# Altium schematic sheet SCHEM FINAL.SchDoc
size A
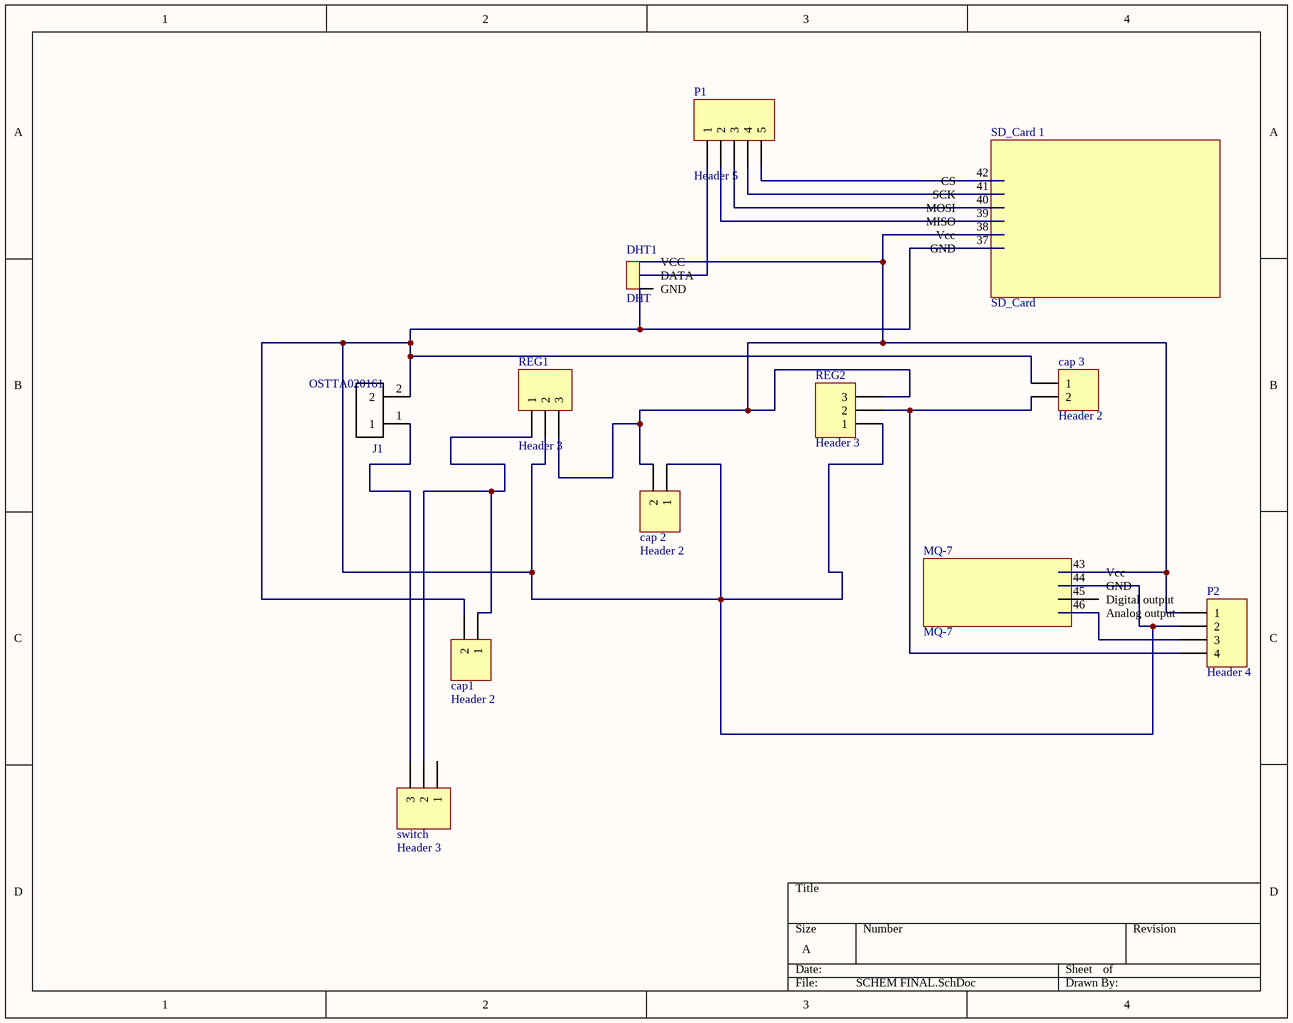
[diagram p0: SCHEM FINAL.SchDoc]

## Parts
cap1  Header 2  [HDR1X2]
cap_2  Header 2  [HDR1X2]
cap_3  Header 2  [HDR1X2]
DHT1  DHT  [PCBComponent_1]
J1  OSTTA020161  [*OST_OSTTA020161]
MQ-7  MQ-7  [MQ-7]
P1  Header 5  [HDR1X5]
P2  Header 4  [HDR1X4]
REG1  Header 3  [HDR1X3]
REG2  Header 3  [HDR1X3]
SD_Card_1  SD_Card  [SD_Card]
switch  Header 3  [HDR1X3]

## Nets
Netcap1_1: cap1.1 REG1.1 switch.2
Netcap1_2: cap1.2 cap_2.1 cap_3.1 DHT1.11(GND) J1.2 MQ-7.44(GND) P2.2 REG1.2 REG2.1 SD_Card_1.37(GND)
Netcap_2_2: cap_2.2 DHT1.9(VCC) MQ-7.43(Vcc) P2.1 REG1.3 REG2.3 SD_Card_1.38(Vcc)
Netcap_3_2: cap_3.2 P2.4 REG2.2
NetDHT1_10: DHT1.10(DATA) P1.1
NetJ1_1: J1.1 switch.3
NetMQ-7_46: MQ-7.46(Analog_output) P2.3
NetP1_2: P1.2 SD_Card_1.39(MISO)
NetP1_3: P1.3 SD_Card_1.40(MOSI)
NetP1_4: P1.4 SD_Card_1.41(SCK)
NetP1_5: P1.5 SD_Card_1.42(CS)

Not connected (* = marked no-connect by the designer): MQ-7 45(Digital_output); switch 1

## Library data of the parts
cap1 cap_2 cap_3 = Header 2: Header, 2-Pin; LatestRevisionDate: 17-Jul-2002; LatestRevisionNote: Re-released for DXP Platform.; Publisher: Altium Limited
J1 = OSTTA020161: Connector Terminal Blocks 2 Position 5mm Solder Straight Thru-Hole 16A; MF: On Shore; Price: None; Package: None; Availability: Unavailable; SnapEDA_Link: https://www.snapeda.com/parts/OSTTA020161/On%20Shore%20Technology%20Inc./view-part/?ref=snap; MP: OSTTA020161; Value: *
P1 = Header 5: Header, 5-Pin; LatestRevisionDate: 17-Jul-2002; LatestRevisionNote: Re-released for DXP Platform.; Publisher: Altium Limited
P2 = Header 4: Header, 4-Pin; LatestRevisionDate: 17-Jul-2002; LatestRevisionNote: Re-released for DXP Platform.; Publisher: Altium Limited
REG1 REG2 switch = Header 3: Header, 3-Pin; LatestRevisionDate: 17-Jul-2002; LatestRevisionNote: Re-released for DXP Platform.; Publisher: Altium Limited